# EAGLE design scheme (EAGLE 7.2.0)
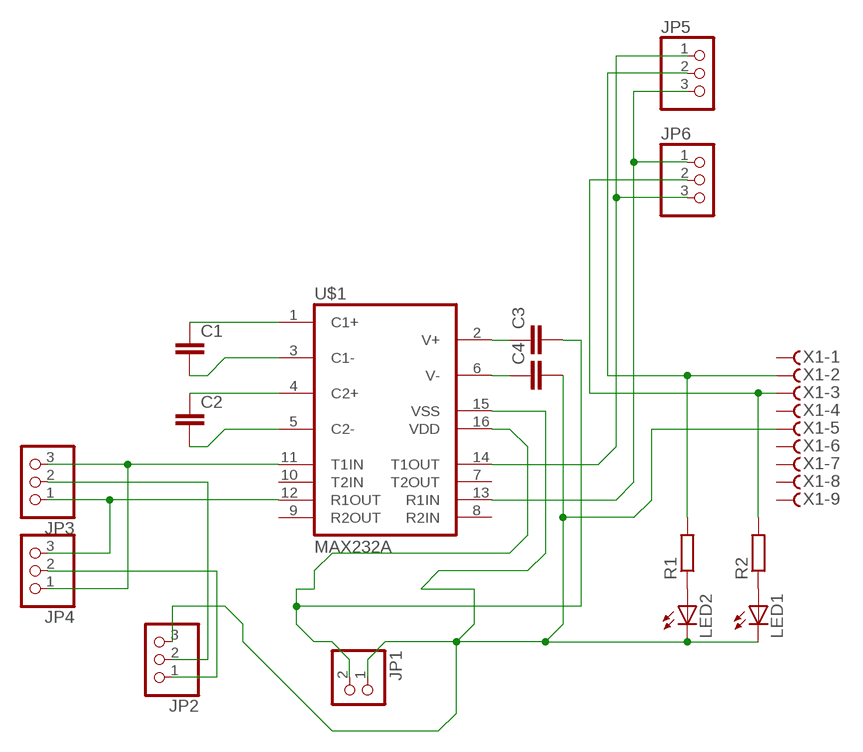
[diagram p0: schematic, sheet 1]

## Parts
C1  C-EUC1206  [C1206]
C2  C-EUC1206  [C1206]
C3  C-EUC1206  [C1206]
C4  C-EUC1206  [C1206]
JP1  PINHD-1X2  [1X02]
JP2  PINHD-1X3  [1X03]
JP3  PINHD-1X3  [1X03]
JP4  PINHD-1X3  [1X03]
JP5  PINHD-1X3  [1X03]
JP6  PINHD-1X3  [1X03]
LED1  LED3MM  [LED3MM]
LED2  LED3MM  [LED3MM]
R1  R-EU_R1206  [R1206]
R2  R-EU_R1206  [R1206]
U$1  MAX232A  [SO16]
X1  F09HS  [F09H]

## Nets
N$1: C1.1 U$1.1(C1+)
N$2: C1.2 U$1.3(C1-)
N$3: C2.1 U$1.4(C2+)
N$4: C2.2 U$1.5(C2-)
N$6: C3.2 JP1.2 U$1.16(VDD)
N$7: JP3.3 JP4.1 U$1.11(T1IN)
N$8: JP3.1 JP4.3 U$1.12(R1OUT)
N$9: JP2.2 JP3.2
N$10: JP2.1 JP4.2
N$11: JP6.2 R2.2 X1.3
N$12: C3.1 U$1.2(V+)
N$13: C4.1 U$1.6(V-)
N$14: JP5.1 JP6.3 U$1.14(T1OUT)
N$15: C4.2 JP1.1 JP2.3 LED1.K(C) LED2.K(C) U$1.15(VSS) X1.5
N$16: JP5.2 R1.2 X1.2
N$17: JP5.3 JP6.1 U$1.13(R1IN)
N$18: LED1.A R2.1
N$19: LED2.A R1.1
Unconnected: U$1.7(T2OUT) U$1.8(R2IN) U$1.9(R2OUT) U$1.10(T2IN) X1.1 X1.4 X1.6 X1.7 X1.8 X1.9

## Library data of the parts
C1-C4 = rcl:C-EU: CAPACITOR, European symbol
JP1 = pinhead:PINHD-1X2: PIN HEADER
JP2 = pinhead:PINHD-1X3: PIN HEADER
JP3-JP6 = adafruit:PINHD-1X3: PIN HEADER
LED1 LED2 = led:LED: LED OSRAM: - CHIPLED LG R971, LG N971, LY N971, LG Q971, LY Q971, LO R971, LY R971 LH N974, LH R974 LS Q976, LO Q976, LY Q976 LO Q996 - Hyper CHIPLED LW Q18S LB Q993, LB Q99A, LB R99A - SideLED LS A670, LO A670, LY A670, LG A670, LP A670 LB A673, LV A673, LT A673, LW A673 LH A674 LY A675 LS A676, LA A676, LO A676, LY A676, LW A676 LS A679, LY A679, LG A679 - Hyper Micro SIDELED® LS Y876, LA Y876, LO Y876, LY Y876 LT Y87S - SmartLED LW L88C, LW L88S LB L89C, LB L89S, LG L890 LS L89K, LO L89K, LY L89K LS L896, LA L896, LO L896, LY L896 - TOPLED LS T670, LO T670, LY T670, LG T670, LP T670 LSG T670, LSP T670, LSY T670, LOP T670, LYG T670 LG T671, LOG T671, LSG T671 LB T673, LV T673, LT T673, LW T673 LH T674 LS T676, LA T676, LO T676, LY T676, LB T676, LH T676, LSB T676, LW T676 LB T67C, LV T67C, LT T67C, LS T67K, LO T67K, LY T67K, LW E67C LS E67B, LA E67B, LO E67B, LY E67B, LB E67C, LV E67C, LT E67C LW T67C LS T679, LY T679, LG T679 LS T770, LO T770, LY T770, LG T770, LP T770 LB T773, LV T773, LT T773, LW T773 LH T774 LS E675, LA E675, LY E675, LS T675 LS T776, LA T776, LO T776, LY T776, LB T776 LHGB T686 LT T68C, LB T68C - Hyper Mini TOPLED® LB M676 - Mini TOPLED Santana® LG M470 LS M47K, LO M47K, LY M47K Source: http://www.osram.convergy.de LUXEON: - LUMILED® LXK2-PW12-R00, LXK2-PW12-S00, LXK2-PW14-U00, LXK2-PW14-V00 LXK2-PM12-R00, LXK2-PM12-S00, LXK2-PM14-U00 LXK2-PE12-Q00, LXK2-PE12-R00, LXK2-PE12-S00, LXK2-PE14-T00, LXK2-PE14-U00 LXK2-PB12-K00, LXK2-PB12-L00, LXK2-PB12-M00, LXK2-PB14-N00, LXK2-PB14-P00, LXK2-PB14-Q00 LXK2-PR12-L00, LXK2-PR12-M00, LXK2-PR14-Q00, LXK2-PR14-R00 LXK2-PD12-Q00, LXK2-PD12-R00, LXK2-PD12-S00 LXK2-PH12-R00, LXK2-PH12-S00 LXK2-PL12-P00, LXK2-PL12-Q00, LXK2-PL12-R00 Source: www.luxeon.com KINGBRIGHT: KA-3528ASYC Source: www.kingbright.com
R1 R2 = rcl:R-EU_: RESISTOR, European symbol
U$1 = maxim:MAX232A: Maxim 232a SO-16 small TTL-RS232
X1 = con-subd:F09?S: SUB-D; OC_FARNELL: unknown; OC_NEWARK: unknown

## Board
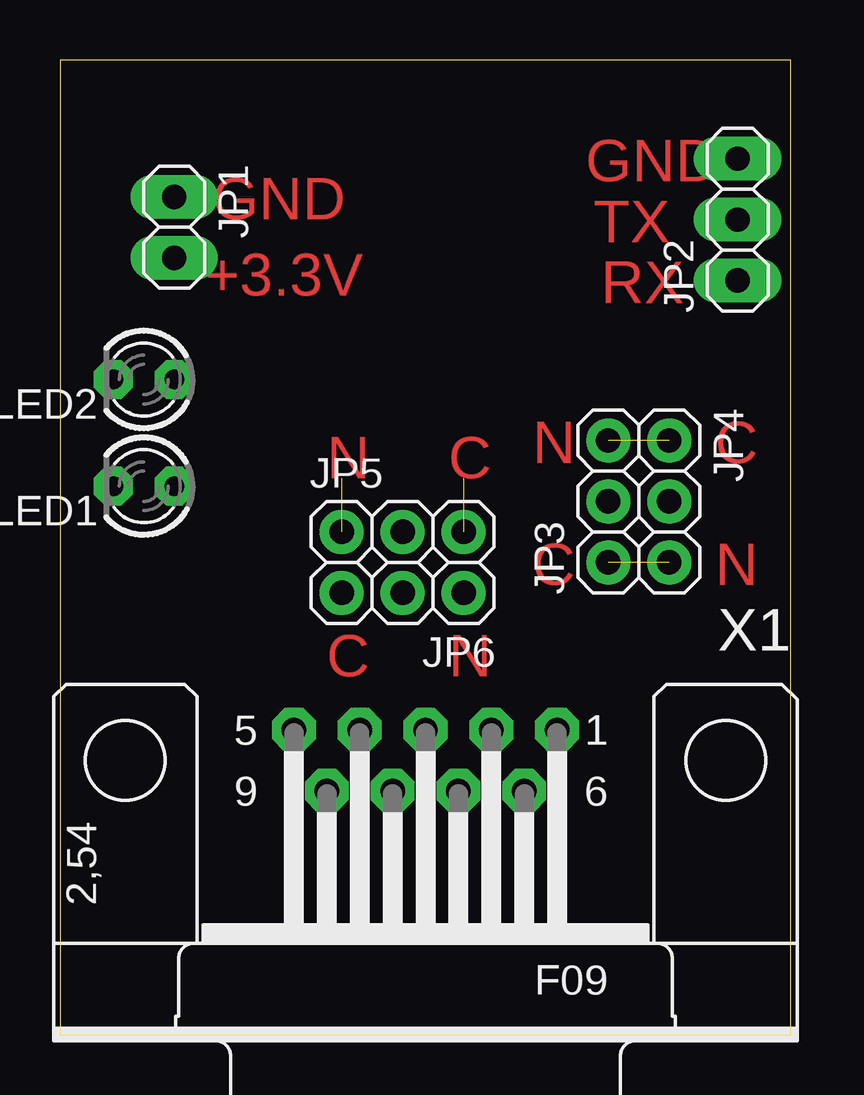
[diagram p1: board, top side]
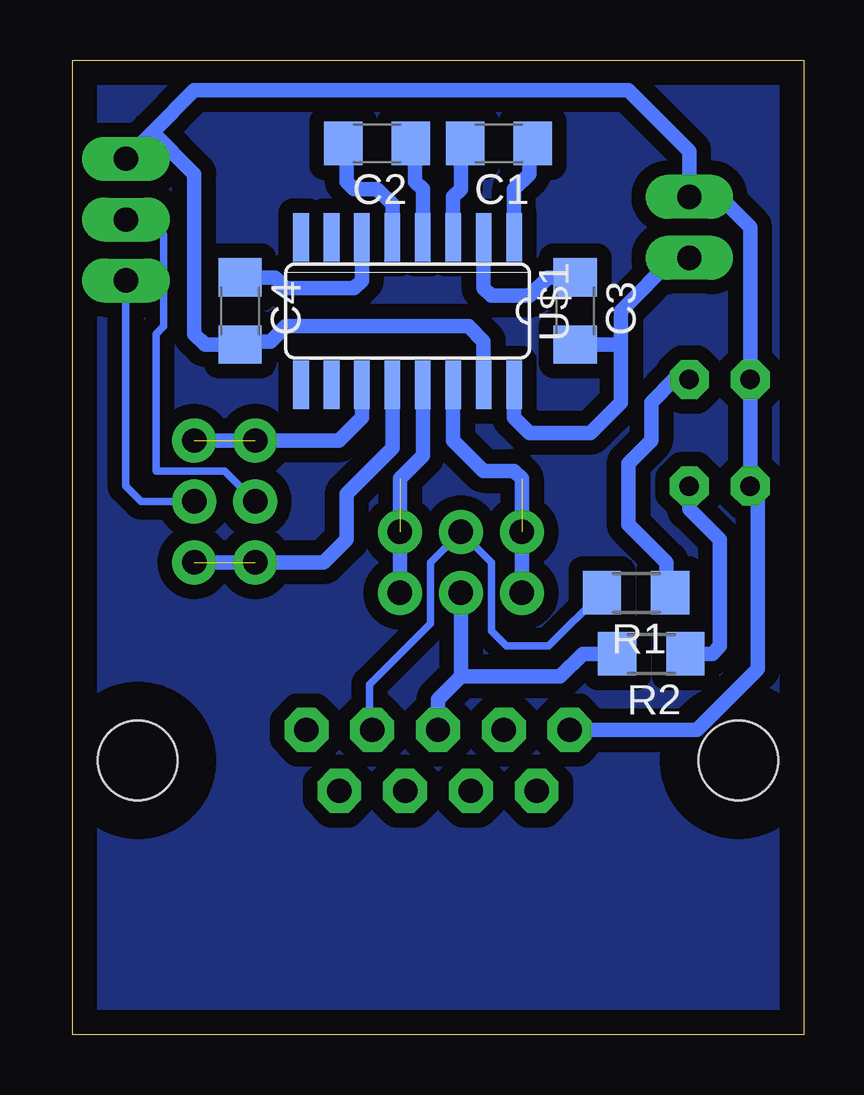
[diagram p2: board, bottom side, seen from below]

Size 30.46 x 40.63 mm. Coordinates in mm from the lower left corner, seen from the top.
Outline: 0,0 30.46,0 30.46,40.63 0,40.63 0,0
Copper layers (1*16): Top 0.035mm / dielectric 1.5mm / Bottom 0.035mm
Design rules "default *": minimum track width 10mil, minimum drill 24mil, track to track 8mil, track to pad 8mil, pad to pad 8mil, via to via 8mil, smd to smd 8mil, copper to edge 40mil, drill to drill 8mil, minimum pad ring 16mil, minimum via ring 15mil, stop-mask expansion 4mil, vias tented up to drill 0mil, thermal gap 10mil

### Footprints (pad centres in the part's own frame; a part is rotated, then mirrored left to right if it is on the bottom)
C1206 = smd 1.6 x 1.8: 1 -1.4,0; 2 1.4,0
1X02 = drill 1.016 long: 1 -1.27,0; 2 1.27,0
1X03 = drill 1.016 long: 1 -2.54,0; 2 0,0; 3 2.54,0
1X03' = drill 1.016: 1 -2.54,0; 2 0,0; 3 2.54,0
LED3MM = drill 0.813 octagon: A -1.27,0; K 1.27,0
R1206 = smd 1.6 x 1.803: 1 -1.422,0; 2 1.422,0
SO16 = smd 0.66 x 2.032: 1 -4.445,-3.073; 2 -3.175,-3.073; 3 -1.905,-3.073; 4 -0.635,-3.073; 5 0.635,-3.073; 6 1.905,-3.073; 7 3.175,-3.073; 8 4.445,-3.073; 9 4.445,3.073; 10 3.175,3.073; 11 1.905,3.073; 12 0.635,3.073; 13 -0.635,3.073; 14 -1.905,3.073; 15 -3.175,3.073; 16 -4.445,3.073
F09H = drill 1.016 octagon: 1 -5.486,-1.27; 2 -2.743,-1.27; 3 0,-1.27; 4 2.743,-1.27; 5 5.486,-1.27; 6 -4.115,1.27; 7 -1.372,1.27; 8 1.372,1.27; 9 4.115,1.27 | hole 3.302: -12.522,0; 12.522,0

### Placement (x,y rotation side)
C1  12.7,37.15 180 bottom
C2  17.78,37.15 180 bottom
C3  9.53,30.16 270 bottom
C4  23.5,30.16 270 bottom
JP1  4.76,33.66 270 top
JP2  28.26,33.97 90 top
JP3  [1X03']  22.86,22.23 90 top
JP4  [1X03']  25.4,22.23 270 top
JP5  [1X03']  14.29,20.95 0 top
JP6  [1X03']  14.29,18.41 180 top
LED1  3.49,22.86 180 top
LED2  3.49,27.3 180 top
R1  6.99,18.41 180 bottom
R2  6.35,15.88 180 bottom
U$1  16.51,30.16 180 bottom
X1  15.24,11.43 180 top

### Tracks (layer width: path | path; a pad name or v marks a point on that pad's centre or on a via)
N$1
  Bottom 0.61: U$1.1 12.06,35.24 11.43,35.88 11.43,37.02 C1.1
N$2
  Bottom 0.61: U$1.3 14.61,34.92 14.29,35.24 14.29,36.96 C1.2
N$3
  Bottom 0.61: U$1.4 15.88,35.24 16.19,35.56 16.19,36.96 C2.1
N$4
  Bottom 0.61: U$1.5 17.14,34.61 17.78,35.24 18.73,35.24 19.05,35.56 19.05,37.02 C2.2
N$5
  pour Bottom (isolate 0.61): 0,40.64 0,0 30.48,0 30.48,40.64
N$6
  Bottom 0.61: JP1.2 5.4,32.38 7.62,30.16 7.62,28.89 | 7.62,28.89 7.62,26.35 8.89,25.08 11.43,25.08 12.06,25.72 U$1.16 | C3.2 7.75,28.76 7.62,28.89
N$7  (1 unrouted)
  Bottom 0.61: U$1.11 18.41,25.72 19.37,24.77 JP4.1
N$8  (1 unrouted)
  Bottom 0.61: U$1.12 17.14,24.45 19.05,22.54 19.05,20.64 20,19.68 JP4.3
N$9
  Bottom 0.305: JP3.2 24.13,23.5 26.99,23.5 26.99,29.21 26.67,29.53 26.67,33.34 27.3,33.97 JP2.2
N$10
  Bottom 0.305: JP4.2 27.62,22.23 28.26,22.86 JP2.1
N$11
  Bottom 0.61: JP6.2 14.29,14.92 | X1.3 15.24,13.97 14.61,14.61 14.29,14.92 | R2.2 9.21,15.88 10.16,14.92 14.29,14.92
N$12
  Bottom 0.61: C3.1 10.66,31.56 11.43,30.8 13.02,30.8 13.34,31.11 U$1.2
N$13
  Bottom 0.61: C4.1 22.04,31.56 21.59,31.11 18.73,31.11 18.41,31.43 U$1.6
N$14  (1 unrouted)
  Bottom 0.61: U$1.14 14.61,24.77 13.34,23.5 12.06,23.5 11.75,23.18 JP6.3
N$15
  Bottom 0.61: 27.15,37.62 25.4,39.37 7.3,39.37 4.76,36.83 JP1.1 3.49,34.92 2.22,33.66 LED2.K LED1.K 1.91,22.54 1.91,15.24 4.45,12.7 X1.5 | 27.15,37.62 JP2.3 | 27.15,37.62 25.4,35.88 25.4,29.21 24.95,28.76 C4.2 23.36,28.89 22.23,28.89 21.59,29.53 13.97,29.53 13.34,28.89 U$1.15
N$16
  Bottom 0.305: X1.2 18.1,12.81 18.1,14.61 15.56,17.14 15.56,19.68 JP5.2 13.02,19.68 13.02,16.83 12.38,16.19 10.63,16.19 R1.2
N$17  (1 unrouted)
  Bottom 0.61: U$1.13 15.88,24.13 16.83,23.18 JP6.1
N$18
  Bottom 0.61: LED1.A 4.76,21.91 3.49,20.64 3.49,16.19 3.81,15.88 R2.1
N$19
  Bottom 0.61: LED2.A 5.4,27.3 6.35,26.35 6.35,24.77 7.3,23.81 7.3,21.27 5.71,19.68 5.71,18.57 R1.1

### Text on the board
Top: GND | GND | TX | +3.3V | RX | N | C | N | C | C | N | C | N
Signs: + | 5V | - | TX | G | TX | TTL | RX | RX